# Altium schematic sheet pwr.SchDoc
size A4; SheetNumber: 1; SheetTotal: 4
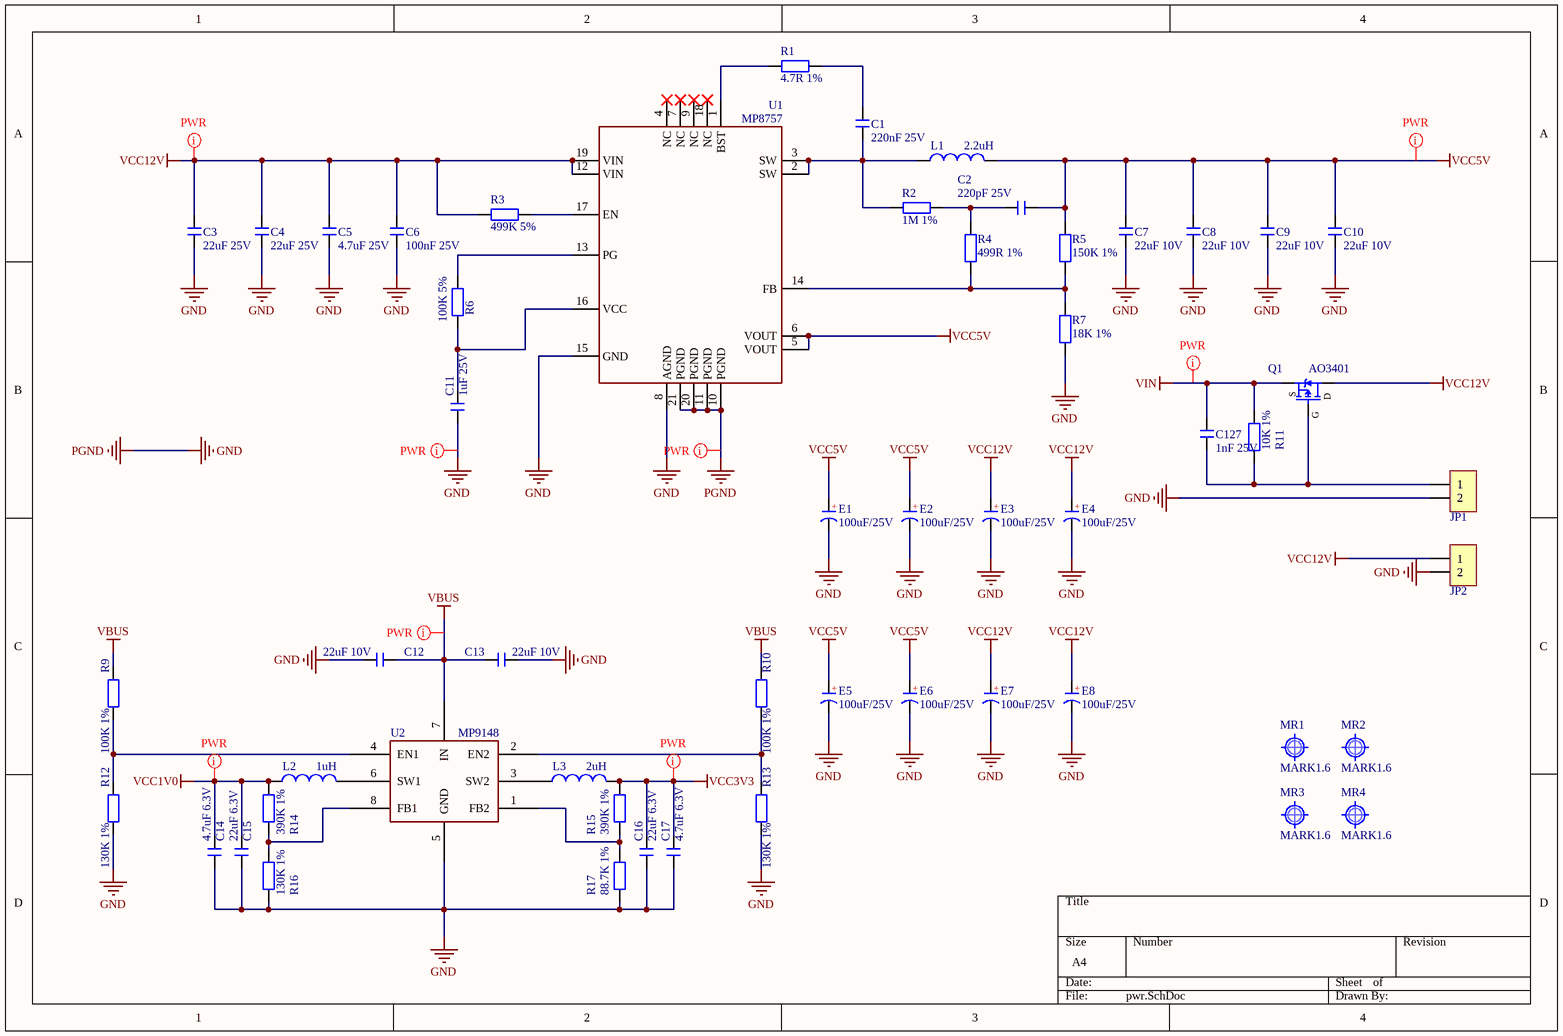
[diagram p0: pwr.SchDoc]

## Parts
C1  220nF 25V  [C0402_L]
C2  220pF 25V  [C0402_L]
C3  22uF 25V  [C0805_L]
C4  22uF 25V  [C0805_L]
C5  4.7uF 25V  [C0805_L]
C6  100nF 25V  [C0805_L]
C7  22uF 10V  [C0805_L]
C8  22uF 10V  [C0805_L]
C9  22uF 10V  [C0805_L]
C10  22uF 10V  [C0805_L]
C11  1uF 25V  [C0402_L]
C12  22uF 10V  [C0603_L]
C13  22uF 10V  [C0603_L]
C14  4.7uF 6.3V  [C0603_L]
C15  22uF 6.3V  [C0603_L]
C16  22uF 6.3V  [C0603_L]
C17  4.7uF 6.3V  [C0603_L]
C127  1nF 25V  [C0402_L]
E1  100uF/25V  [CS 6*4 - B]
E2  100uF/25V  [CS 6*4 - B]
E3  100uF/25V  [CS 6*4 - B]
E4  100uF/25V  [CS 6*4 - B]
E5  100uF/25V  [CS 6*4 - B]
E6  100uF/25V  [CS 6*4 - B]
E7  100uF/25V  [CS 6*4 - B]
E8  100uF/25V  [CS 6*4 - B]
JP1  HDR-1X2  [ZH1.5-WS-2P]  (value not drawn)
JP2  HDR-1X2  [XH2.54-WS-2P]  (value not drawn)
L1  2.2uH  [NR8040]
L2  1uH  [NR4020]
L3  2uH  [NR4020]
MR1  MARK1.6  [Mark 1]
MR2  MARK1.6  [Mark 1]
MR3  MARK1.6  [Mark 1]
MR4  MARK1.6  [Mark 1]
Q1  AO3401  [DFN8-L3.0-W3.0-P0.65_EP]
R1  4.7R 1%  [R0402_L]
R2  1M 1%  [R0402_L]
R3  499K 5%  [R0402_L]
R4  499R 1%  [R0402_L]
R5  150K 1%  [R0402_L]
R6  100K 5%  [R0402_L]
R7  18K 1%  [R0402_L]
R9  100K 1%  [R0402_L]
R10  100K 1%  [R0402_L]
R11  10K 1%  [R0402_L]
R12  130K 1%  [R0402_L]
R13  130K 1%  [R0402_L]
R14  390K 1%  [R0402_L]
R15  390K 1%  [R0402_L]
R16  130K 1%  [R0402_L]
R17  88.7K 1%  [R0402_L]
U1  MP8757  [MP8757]
U2  MP9148  [SOT23-8]

## Nets
GND: C3.1 C4.1 C5.1 C6.1 C7.1 C8.1 C9.1 C10.1 C11.1 C12.1 C13.1 C14.1 C15.1 C16.1 C17.1 E1.2(K) E2.2(K) E3.2(K) E4.2(K) E5.2(K) E6.2(K) E7.2(K) E8.2(K) JP1.2 JP2.2 R7.1 R12.2 R13.2 R16.2 R17.2 U1.8(AGND) U1.10(PGND) U1.11(PGND) U1.15(GND) U1.20(PGND) U1.21(PGND) U2.5(GND)  [also labelled PGND]
VBUS: C12.2 C13.2 R9.1 R10.1 U2.7(IN)
VCC1V0: C14.2 C15.2 L2.1 R14.1
VCC3V3: C16.2 C17.2 L3.1 R15.1
VCC5V: C2.1 C7.2 C8.2 C9.2 C10.2 E1.1(A) E2.1(A) E5.1(A) E6.1(A) L1.1 R5.2 U1.5(VOUT) U1.6(VOUT)
VCC12V: C3.2 C4.2 C5.2 C6.2 E3.1(A) E4.1(A) E7.1(A) E8.1(A) JP2.1 Q1.3(D) R3.1 U1.12(VIN) U1.19(VIN)
VIN: C127.1 Q1.2(S) R11.1
NetC1_1: C1.1 R1.2
NetC1_2: C1.2 L1.2 R2.1 U1.2(SW) U1.3(SW)
NetC2_2: C2.2 R2.2 R4.1
NetC11_2: C11.2 R6.1 U1.16(VCC)
NetC127_2: C127.2 JP1.1 Q1.1(G) R11.2
NetL2_2: L2.2 U2.6(SW1)
NetL3_2: L3.2 U2.3(SW2)
NetR1_1: R1.1 U1.1(BST)
NetR3_2: R3.2 U1.17(EN)
NetR4_2: R4.2 R5.1 R7.2 U1.14(FB)
NetR6_2: R6.2 U1.13(PG)
NetR9_2: R9.2 R12.1 U2.4(EN1)
NetR10_2: R10.2 R13.1 U2.2(EN2)
NetR14_2: R14.2 R16.1 U2.8(FB1)
NetR15_2: R15.2 R17.1 U2.1(FB2)

Not connected (* = marked no-connect by the designer): U1 4(NC)* 7(NC)* 9(NC)* 18(NC)*

## Layout directives
net class PWR: GND, VBUS, VCC1V0, VCC3V3, VCC5V, VCC12V, VIN

## Notes on the sheet
- (in symbol C-CD) +

## Library data of the parts
C1-C17 C127 = C: 无极性贴片电容; 版权归属: 源创客; 材质: X7R; BOM名称: 无极性贴片电容; 学习资源: www.ooocke.com
E1-E8 = C-CD: 贴片钽电容; 版权归属: 源创客; BOM名称: 贴片钽电容; 学习资源: www.ooocke.com
JP1 JP2 = Header 2: 2P接插件; 版权归属: 源创客; BOM名称: 2P接插件; 学习资源: www.ooocke.com
L1-L3 = L: 小功率贴片电感; 版权归属: 源创客; BOM名称: 小功率贴片电感; 学习资源: www.ooocke.com
MR1-MR4 = MARK: 光学定位点; 版权归属: 源创客; BOM名称: 光学定位点; 学习资源: www.ooocke.com
Q1 = AO3401: P沟道 30V/4.2A; BOM名称: 场效应管; 版权归属: 源创客; 学习资源: www.ooocke.com; 描述: P沟道 30V/4.2A
R1-R7 R9-R17 = R: 贴片电阻; 版权归属: 源创客; BOM名称: 贴片电阻; 学习资源: www.ooocke.com
U1 = MP8757: DCDC控制器
U2 = MP9148: BUCK